# Altium project CyberDeck.PrjPcb
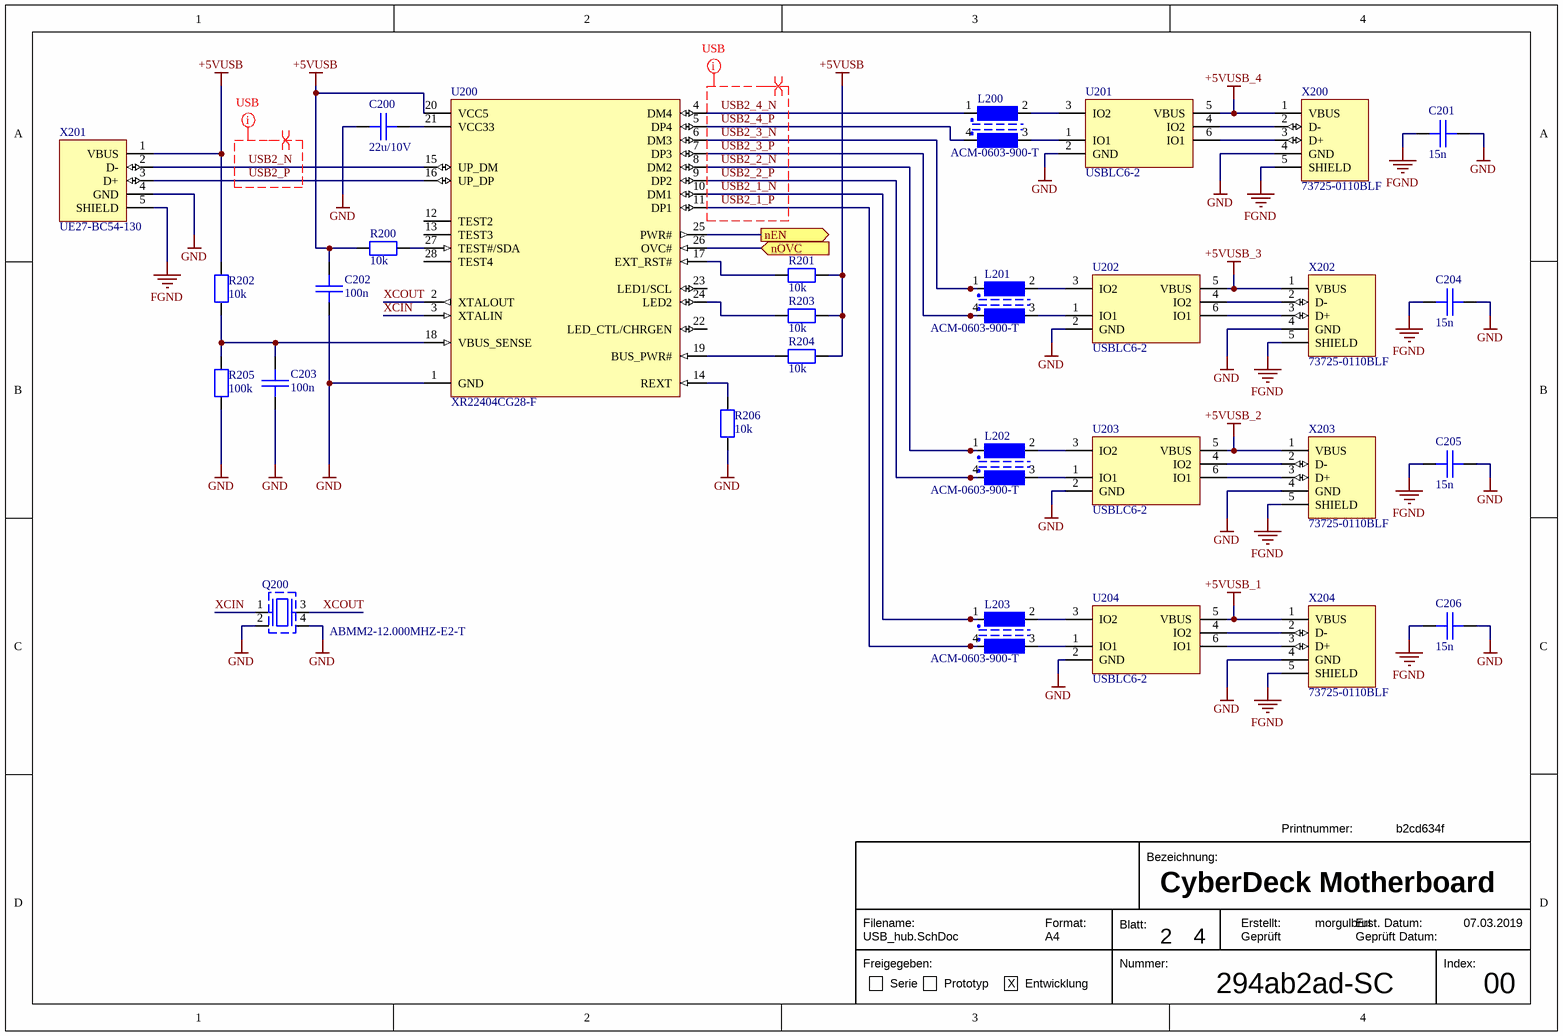
[diagram p0: USB_hub.SchDoc]
Pr_Artikel_Nr: 294ab2ad; Pr_Artikel_Revision: 00; Pr_Bezeichnung: CyberDeck Motherboard; Pr_Erstellt: morgulbrut; Pr_Erstellt_Datum: 07.03.2019; Pr_Firma: Ono-Sendai; Pr_Freig_Entw: X; Pr_PCB_Nr: b2cd634f; Pr_PCB_Revision: 00
4 sheets, 72 parts. Net scope: flat (ports and power ports of the same name join across sheets).
Board file: Cyberdeck.PcbDoc
Sheets:
  USB_hub.SchDoc
  RaspiConnection.SchDoc
  Backside.SchDoc
  USBPower.SchDoc

## Sheet USB_hub.SchDoc: USB Hub
size A4; DocumentNumber: 2; SheetNumber: 2; SheetTotal: 4; RelSerie: X

### Parts
C200  22u/10V  [0805_C_E0]
C201  15n  [0603_C]
C202  100n  [0603_C]
C203  100n  [0603_C]
C204  15n  [0603_C]
C205  15n  [0603_C]
C206  15n  [0603_C]
L200  ACM-0603-900-T  [ACM-0603-900-T]
L201  ACM-0603-900-T  [ACM-0603-900-T]
L202  ACM-0603-900-T  [ACM-0603-900-T]
L203  ACM-0603-900-T  [ACM-0603-900-T]
Q200  ABMM2-12.000MHZ-E2-T  [ABMM2]
R200  10k  [0805_R]
R201  10k  [0805_R]
R202  10k  [0805_R]
R203  10k  [0805_R]
R204  10k  [0805_R]
R205  100k  [0805_R]
R206  10k  [0805_R]
U200  XR22404CG28-F  [SSOP-28]
U201  USBLC6-2  [SOT-666]
U202  USBLC6-2  [SOT-666]
U203  USBLC6-2  [SOT-666]
U204  USBLC6-2  [SOT-666]
X200  73725-0110BLF  [73725-0110BLF]
X201  UE27-BC54-130  [UE27BC54130]
X202  73725-0110BLF  [73725-0110BLF]
X203  73725-0110BLF  [73725-0110BLF]
X204  73725-0110BLF  [73725-0110BLF]

### Ports
nEN (out), nOVC (in)

### Nets
+5VUSB: C202.2 R200.2 R201.2 R202.2 R203.2 R204.1 U200.20(VCC5) X201.1(VBUS)
+5VUSB_1: U204.5(VBUS) X204.1(VBUS)
+5VUSB_2: U203.5(VBUS) X203.1(VBUS)
+5VUSB_3: U202.5(VBUS) X202.1(VBUS)
+5VUSB_4: U201.5(VBUS) X200.1(VBUS)
FGND: C201.1 C204.1 C205.1 C206.1 X200.5(SHIELD) X201.5(SHIELD) X202.5(SHIELD) X203.5(SHIELD) X204.5(SHIELD)
GND: C200.2 C201.2 C202.1 C203.1 C204.2 C205.2 C206.2 Q200.2 Q200.4 R205.1 R206.2 U200.1(GND) U201.2(GND) U202.2(GND) U203.2(GND) U204.2(GND) X200.4(GND) X201.4(GND) X202.4(GND) X203.4(GND) X204.4(GND)
nEN: U200.25(PWR#) ; port nEN
nOVC: U200.26(OVC#) ; port nOVC
USB2_1_N: L203.1 U200.10(DM1)
USB2_1_P: L203.4 U200.11(DP1)
USB2_2_N: L202.1 U200.8(DM2)
USB2_2_P: L202.4 U200.9(DP2)
USB2_3_N: L201.1 U200.6(DM3)
USB2_3_P: L201.4 U200.7(DP3)
USB2_4_N: L200.1 U200.4(DM4)
USB2_4_P: L200.4 U200.5(DP4)
USB2_N: U200.15(UP_DM) X201.2(D-)
USB2_P: U200.16(UP_DP) X201.3(D+)
XCIN: Q200.1 U200.3(XTALIN)
XCOUT: Q200.3 U200.2(XTALOUT)
NetC200_1: C200.1 U200.21(VCC33)
NetC203_2: C203.2 R202.1 R205.2 U200.18(VBUS_SENSE)
NetL200_2: L200.2 U201.3(IO2)
NetL200_3: L200.3 U201.1(IO1)
NetL201_2: L201.2 U202.3(IO2)
NetL201_3: L201.3 U202.1(IO1)
NetL202_2: L202.2 U203.3(IO2)
NetL202_3: L202.3 U203.1(IO1)
NetL203_2: L203.2 U204.3(IO2)
NetL203_3: L203.3 U204.1(IO1)
NetR200_1: R200.1 U200.27(TEST#/SDA)
NetR201_1: R201.1 U200.17(EXT_RST#)
NetR203_1: R203.1 U200.24(LED2)
NetR204_2: R204.2 U200.19(BUS_PWR#)
NetR206_1: R206.1 U200.14(REXT)
NetU201_4: U201.4(IO2) X200.2(D-)
NetU201_6: U201.6(IO1) X200.3(D+)
NetU202_4: U202.4(IO2) X202.2(D-)
NetU202_6: U202.6(IO1) X202.3(D+)
NetU203_4: U203.4(IO2) X203.2(D-)
NetU203_6: U203.6(IO1) X203.3(D+)
NetU204_4: U204.4(IO2) X204.2(D-)
NetU204_6: U204.6(IO1) X204.3(D+)

Not connected (* = marked no-connect by the designer): U200 12(TEST2) 13(TEST3) 22(LED_CTL/CHRGEN) 23(LED1/SCL) 28(TEST4)

### Layout directives
differential pair: USB2_1_N, USB2_1_P, USB2_2_N, USB2_2_P, USB2_3_N, USB2_3_P, USB2_4_N, USB2_4_P, USB2_N, USB2_P
net class USB: USB2_1_N, USB2_1_P, USB2_2_N, USB2_2_P, USB2_3_N, USB2_3_P, USB2_4_N, USB2_4_P, USB2_N, USB2_P

### Notes on the sheet
- Bezeichnung:
- Printnummer:
- Filename:
- Format:
- Blatt:
- Erstellt:
- Erst. Datum:
- Freigegeben:
- Serie
- Prototyp
- Entwicklung
- A4
- Nummer:
- Geprüft
- Geprüft Datum:
- Index:

### Library data of the parts
C200-C206 = C: Chip capacitor, generic
L200-L203 = L_ACM-0603-900-T: INDUCTOR COMMON MODE SMD; Manufacturer: Abracon; Max Output Current: 200mA; Number of Inputs: 1; Supplier 1: Digi-Key; Supplier Part Number 1: 535-12407-1-ND; Manufacturer Part Number: ACM-0603-900-T; Case/Package: 0603; ComponentLink1URL: https://datasheet.ciiva.com/29370/acm-0603-29370512.pdf; ComponentLink1Description: https://datasheet.ciiva.com/29370/acm-0603-29370512.pdf; ComponentLink2Description: http://www.mouser.com/ds/2/115/AP21410_21510-740863.pdf; ComponentLink2URL: http://www.mouser.com/ds/2/115/AP21410_21510-740863.pdf; ComponentLink3Description: http://www.diodes.com/_files/datasheets/AP21410_21510.pdf; ComponentLink3URL: http://www.diodes.com/_files/datasheets/AP21410_21510.pdf; Contact Plating: Tin,Matte; Max Operating Temperature: 85°C; Min Operating Temperature: -40°C; Mount: Surface Mount; Number of Outputs: 1; Pricing 2: 1=0.41, 10=0.351, 100=0.2624, 500=0.2062, 1000=0.15934 (USD); Stock 2: 2006; Supplier 2: Digi-Key; Supplier Part Number 2: AP21410FM-7DICT-ND
Q200 = Q_ABMM2-12.000MHZ-E2-T: 12MHz ±20ppm Crystal 18pF 50 Ohm -20°C ~ 70°C  Surface Mount 4-SMD, No Lead (DFN, LCC); Manufacturer: Abracon; Supplier 1: Digi-Key; Supplier Part Number 1: 535-9631-1-ND; Manufacturer Part Number: ABMM2-12.000MHZ-E2-T; Case/Package: CSMD; ComponentLink1URL: https://datasheet.ciiva.com/15116/getdatasheetpartid-719825-15116727.pdf; ComponentLink1Description: https://datasheet.ciiva.com/15116/getdatasheetpartid-719825-15116727.pdf; ComponentLink2URL: https://datasheet.ciiva.com/855/abmm2-855417.pdf; ComponentLink2Description: https://datasheet.ciiva.com/855/abmm2-855417.pdf; ComponentLink3URL: https://datasheet.ciiva.com/3176/abmm2-3176137.pdf; ComponentLink3Description: https://datasheet.ciiva.com/3176/abmm2-3176137.pdf; ComponentLink4URL: https://datasheet.ciiva.com/855/abmm2-855418.pdf; ComponentLink4Description: https://datasheet.ciiva.com/855/abmm2-855418.pdf; ComponentLink5URL: https://datasheet.ciiva.com/855/abmm2-855419.pdf; ComponentLink5Description: https://datasheet.ciiva.com/855/abmm2-855419.pdf; ComponentLink6URL: https://datasheet.ciiva.com/16214/abmm2-16214428.pdf; ComponentLink6Description: https://datasheet.ciiva.com/16214/abmm2-16214428.pdf
R200-R206 = R: Resistor, generic
U200 = U_T_XR22404CG28-F: USB Controller USB 2.0 USB Interface; Manufacturer: Exar; Supplier 1: Digi-Key; Supplier Part Number 1: 1016-2163-ND; Manufacturer Part Number: XR22404CG28-F; ComponentLink1Description: Datasheet; ComponentLink1URL: https://www.exar.com/ds/xr22404.pdf
U201-U204 = D_USBLC6-2: TVS DIODE 5.25VWM 17VC SOT666; Manufacturer: STMicroelectronics; Manufacturer Part Number: USBLC6-2P6; Supplier 1: Digi-Key; Supplier Part Number 1: 497-5026-1-ND; ComponentLink1URL: https://datasheet.ciiva.com/15143/getdatasheetpartid-98673-15143462.pdf; ComponentLink1Description: https://datasheet.ciiva.com/15143/getdatasheetpartid-98673-15143462.pdf; ComponentLink2URL: https://datasheet.ciiva.com/14186/usblc6-2-st-eng-tds-14186568.pdf; ComponentLink2Description: https://datasheet.ciiva.com/14186/usblc6-2-st-eng-tds-14186568.pdf; ComponentLink3URL: https://datasheet.ciiva.com/22692/1690354-22692453.pdf; ComponentLink3Description: https://datasheet.ciiva.com/22692/1690354-22692453.pdf; ComponentLink4URL: https://datasheet.ciiva.com/22685/1690354-22685832.pdf; ComponentLink4Description: https://datasheet.ciiva.com/22685/1690354-22685832.pdf; ComponentLink5URL: https://datasheet.ciiva.com/16378/cd00050750-16378714.pdf; ComponentLink5Description: https://datasheet.ciiva.com/16378/cd00050750-16378714.pdf; ComponentLink6URL: https://datasheet.ciiva.com/4508/cd00050750-4508892.pdf; ComponentLink6Description: https://datasheet.ciiva.com/4508/cd00050750-4508892.pdf; ComponentLink7URL: https://datasheet.ciiva.com/41444/001184108-da-01-en-ic-esd-protection-usblc6-2p6-sot-666-stm-41444134.pdf; ComponentLink7Description: https://datasheet.ciiva.com/41444/001184108-da-01-en-ic-esd-protection-usblc6-2p6-sot-666-stm-41444134.pdf; Case/Package: SOT-666
X200 X202-X204 = X_73725-0110BLF: CONN RCPT USB2.0 TYPEA 4POS R/A
X201 = X_UE27-BC54-130: USB Connectors 4P PCB R/A TYPE B BLACK W/ REAR SHIELD; Manufacturer 1: Amphenol Commercial; Manufacturer Part Number 1: UE27-BC54-130; ComponentLink1URL: https://datasheet.ciiva.com/10945/ue27bcx4xxx-10945210.pdf; ComponentLink1Description: https://datasheet.ciiva.com/10945/ue27bcx4xxx-10945210.pdf; ComponentLink2URL: https://datasheet.ciiva.com/851/ue27bcx4xxx-851809.pdf; ComponentLink2Description: https://datasheet.ciiva.com/851/ue27bcx4xxx-851809.pdf; ComponentLink3URL: https://datasheet.ciiva.com/16668/ue27bcx4xxx-16668218.pdf; ComponentLink3Description: https://datasheet.ciiva.com/16668/ue27bcx4xxx-16668218.pdf; Supplier 1: Digi-Key; Supplier Part Number 1: UE27BC54130-ND

## Sheet RaspiConnection.SchDoc
size A4; DocumentNumber: 1; SheetNumber: 1; SheetTotal: 4; RelSerie: X
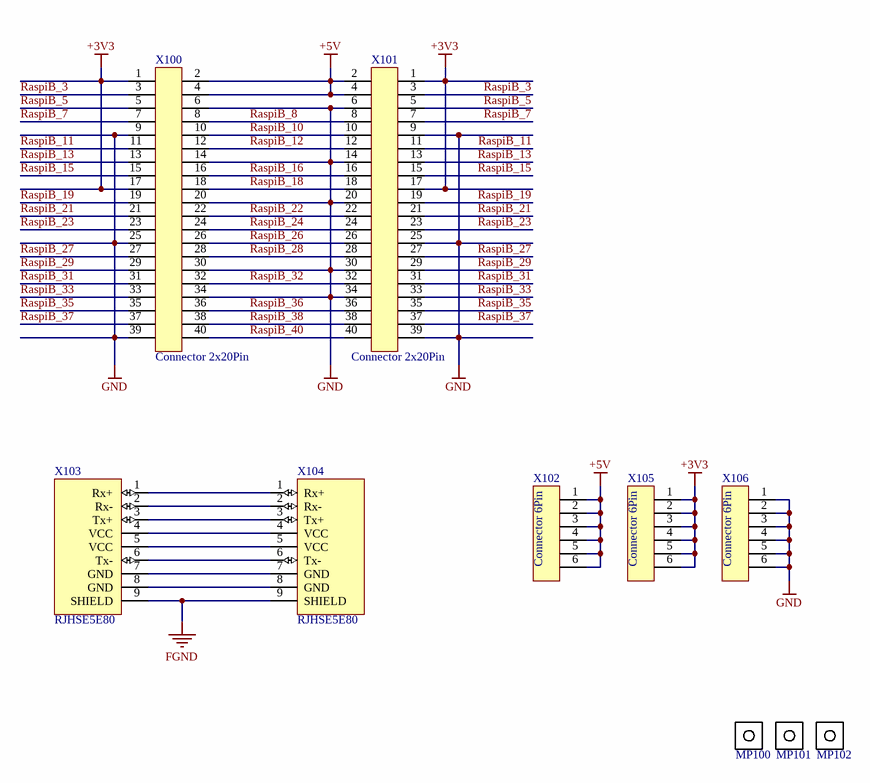
[diagram p1: RaspiConnection.SchDoc]

### Parts
MP100  Mounting Hole  [M3x08S]  (value not drawn)  (no BOM)
MP101  Mounting Hole  [M3x08S]  (value not drawn)  (no BOM)
MP102  Mounting Hole  [M3x08S]  (value not drawn)  (no BOM)
X100  Connector 2x20Pin  [Pin Header 2x20 TH Pitch 2.54mm - sh]
X101  Connector 2x20Pin  [Pin Header 2x20 SMD Pitch 2.54mm F]
X102  Connector 6Pin  [Pin Header 1x6 TH Pitch 2.54mm]
X103  RJHSE5E80  [RJ45]
X104  RJHSE5E80  [RJ45]
X105  Connector 6Pin  [Pin Header 1x6 TH Pitch 2.54mm]
X106  Connector 6Pin  [Pin Header 1x6 TH Pitch 2.54mm]

### Nets
+3V3: X100.1 X100.17 X101.1 X101.17 X105.1 X105.2 X105.3 X105.4 X105.5 X105.6
+5V: X100.2 X100.4 X101.2 X101.4 X102.1 X102.2 X102.3 X102.4 X102.5 X102.6
FGND: X103.9(SHIELD) X104.9(SHIELD)
GND: X100.6 X100.9 X100.14 X100.20 X100.25 X100.30 X100.34 X100.39 X101.6 X101.9 X101.14 X101.20 X101.25 X101.30 X101.34 X101.39 X106.1 X106.2 X106.3 X106.4 X106.5 X106.6
RaspiB_3: X100.3 X101.3
RaspiB_5: X100.5 X101.5
RaspiB_7: X100.7 X101.7
RaspiB_8: X100.8 X101.8
RaspiB_10: X100.10 X101.10
RaspiB_11: X100.11 X101.11
RaspiB_12: X100.12 X101.12
RaspiB_13: X100.13 X101.13
RaspiB_15: X100.15 X101.15
RaspiB_16: X100.16 X101.16
RaspiB_18: X100.18 X101.18
RaspiB_19: X100.19 X101.19
RaspiB_21: X100.21 X101.21
RaspiB_22: X100.22 X101.22
RaspiB_23: X100.23 X101.23
RaspiB_24: X100.24 X101.24
RaspiB_26: X100.26 X101.26
RaspiB_27: X100.27 X101.27
RaspiB_28: X100.28 X101.28
RaspiB_29: X100.29 X101.29
RaspiB_31: X100.31 X101.31
RaspiB_32: X100.32 X101.32
RaspiB_33: X100.33 X101.33
RaspiB_35: X100.35 X101.35
RaspiB_36: X100.36 X101.36
RaspiB_37: X100.37 X101.37
RaspiB_38: X100.38 X101.38
RaspiB_40: X100.40 X101.40
NetX103_1: X103.1(Rx+) X104.1(Rx+)
NetX103_2: X103.2(Rx-) X104.2(Rx-)
NetX103_3: X103.3(Tx+) X104.3(Tx+)
NetX103_4: X103.4(VCC) X104.4(VCC)
NetX103_5: X103.5(VCC) X104.5(VCC)
NetX103_6: X103.6(Tx-) X104.6(Tx-)
NetX103_7: X103.7(GND) X104.7(GND)
NetX103_8: X103.8(GND) X104.8(GND)

### Notes on the sheet
- Bezeichnung:
- Printnummer:
- Filename:
- Format:
- Blatt:
- Erstellt:
- Erst. Datum:
- Freigegeben:
- Serie
- Prototyp
- Entwicklung
- A4
- Nummer:
- Geprüft
- Geprüft Datum:
- Index:

### Library data of the parts
MP100-MP102 = MP_Mounting Hole: Different Mounting holes
X100 = X_Connector 2x20Pin: Generic connector 2x20 Pin
X101 = X_Connector 2x20Pin_1: Generic connector 2x20 Pin
X102 X105 X106 = X_Connector 6Pin: Generic connector 6 Pin
X103 X104 = X_RJHSE5E80: Modular Connectors / Ethernet Connectors High Speed RJ w/no LED's or Shield; Manufacturer 1: Amphenol Commercial; Voltage Rating: 125V; Manufacturer Part Number 1: RJHSE5E80; Termination: Solder; ComponentLink1URL: http://www.mouser.com/ds/2/18/Amphenol_RJHSE_BRO-311217.pdf; ComponentLink1Description: http://www.mouser.com/ds/2/18/Amphenol_RJHSE_BRO-311217.pdf; ComponentLink2URL: https://www.amphenolcanada.com/ProductSearch/pdf/RJHSE_BRO.pdf; ComponentLink2Description: https://www.amphenolcanada.com/ProductSearch/pdf/RJHSE_BRO.pdf; Supplier 1: Digi-Key; Supplier Part Number 1: RJHSE5E80-ND; ComponentLink3URL: https://datasheet.ciiva.com/16408/eng-cd-6368150-b1-16408714.pdf; ComponentLink3Description: https://datasheet.ciiva.com/16408/eng-cd-6368150-b1-16408714.pdf; ComponentLink4URL: https://datasheet.ciiva.com/30494/0900766b8121d3d0-30494389.pdf; ComponentLink4Description: https://datasheet.ciiva.com/30494/0900766b8121d3d0-30494389.pdf; ComponentLink5URL: https://datasheet.ciiva.com/30086/63681501-30086239.pdf; ComponentLink5Description: https://datasheet.ciiva.com/30086/63681501-30086239.pdf; ComponentLink7URL: https://datasheet.ciiva.com/685/eng-cd-6368150-c1-685799.pdf; ComponentLink7Description: https://datasheet.ciiva.com/685/eng-cd-6368150-c1-685799.pdf

## Sheet Backside.SchDoc
size A4; DocumentNumber: 3; SheetNumber: 3; SheetTotal: 4; RelSerie: X
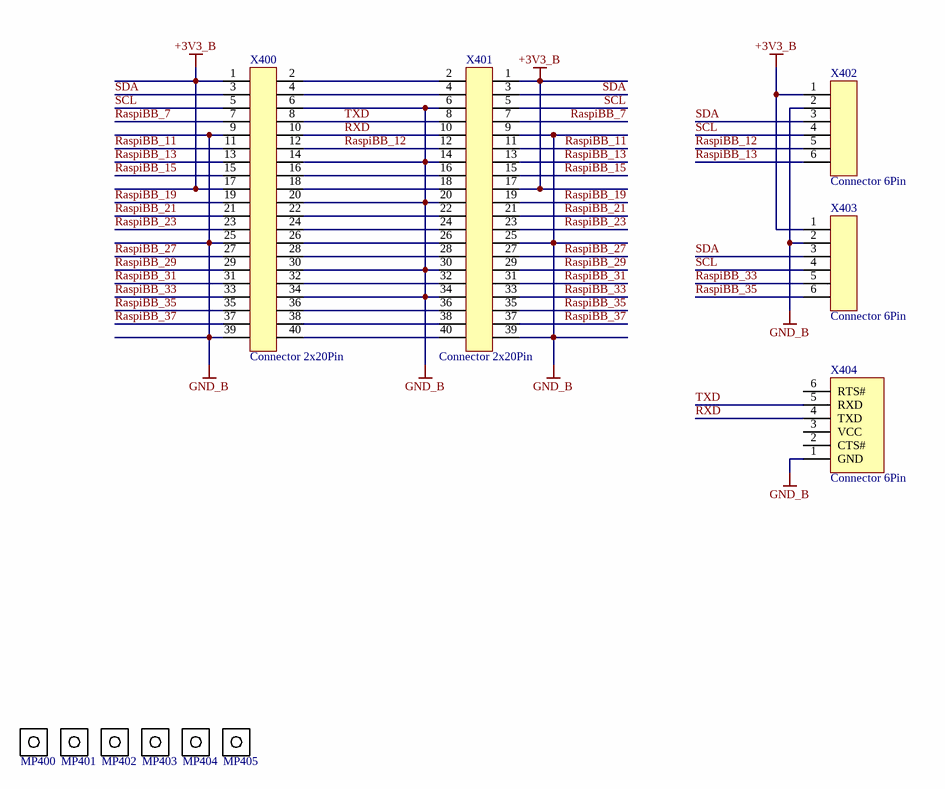
[diagram p2: Backside.SchDoc]

### Parts
MP400  Mounting Hole  [M2 2.3]  (value not drawn)  (no BOM)
MP401  Mounting Hole  [M2 2.3]  (value not drawn)  (no BOM)
MP402  Mounting Hole  [M2 2.3]  (value not drawn)  (no BOM)
MP403  Mounting Hole  [M2 2.3]  (value not drawn)  (no BOM)
MP404  Mounting Hole  [M2 2.3]  (value not drawn)  (no BOM)
MP405  Mounting Hole  [M2 2.3]  (value not drawn)  (no BOM)
X400  Connector 2x20Pin  [Pin Header 2x20 TH Pitch 2.54mm - sh]
X401  Connector 2x20Pin  [Pin Header 2x20 TH Pitch 2.54mm - sh]
X402  Connector 6Pin  [Pin Header 2x3 TH Pitch 2.54mm f]
X403  Connector 6Pin  [Pin Header 2x3 TH Pitch 2.54mm f]
X404  Connector 6Pin  [Pin Header 1x6 TH Pitch 2.54mm]

### Nets
+3V3_B: X400.1 X400.17 X401.1 X401.17 X402.1 X403.1
GND_B: X400.6 X400.9 X400.14 X400.20 X400.25 X400.30 X400.34 X400.39 X401.6 X401.9 X401.14 X401.20 X401.25 X401.30 X401.34 X401.39 X402.2 X403.2 X404.1(GND)
RaspiBB_7: X400.7 X401.7
RaspiBB_11: X400.11 X401.11
RaspiBB_12: X400.12 X401.12 X402.5
RaspiBB_13: X400.13 X401.13 X402.6
RaspiBB_15: X400.15 X401.15
RaspiBB_19: X400.19 X401.19
RaspiBB_21: X400.21 X401.21
RaspiBB_23: X400.23 X401.23
RaspiBB_27: X400.27 X401.27
RaspiBB_29: X400.29 X401.29
RaspiBB_31: X400.31 X401.31
RaspiBB_33: X400.33 X401.33 X403.5
RaspiBB_35: X400.35 X401.35 X403.6
RaspiBB_37: X400.37 X401.37
RXD: X400.10 X401.10 X404.4(TXD)
SCL: X400.5 X401.5 X402.4 X403.4
SDA: X400.3 X401.3 X402.3 X403.3
TXD: X400.8 X401.8 X404.5(RXD)
NetX400_2: X400.2 X401.2
NetX400_4: X400.4 X401.4
NetX400_16: X400.16 X401.16
NetX400_18: X400.18 X401.18
NetX400_22: X400.22 X401.22
NetX400_24: X400.24 X401.24
NetX400_26: X400.26 X401.26
NetX400_28: X400.28 X401.28
NetX400_32: X400.32 X401.32
NetX400_36: X400.36 X401.36
NetX400_38: X400.38 X401.38
NetX400_40: X400.40 X401.40

Not connected (* = marked no-connect by the designer): X404 2(CTS#) 3(VCC) 6(RTS#)

### Notes on the sheet
- Bezeichnung:
- Printnummer:
- Filename:
- Format:
- Blatt:
- Erstellt:
- Erst. Datum:
- Freigegeben:
- Serie
- Prototyp
- Entwicklung
- A4
- Nummer:
- Geprüft
- Geprüft Datum:
- Index:

### Library data of the parts
MP400-MP405 = MP_Mounting Hole: Different Mounting holes
X400 X401 = X_Connector 2x20Pin: Generic connector 2x20 Pin
X402 X403 = X_Connector 6Pin: Generic connector 6 Pin
X404 = X_Connector FTDI cable: Connector 6 Pin for FTDI cable; Manufacturer: Mill-Max; Manufacturer Part Number: 419-10-206-00-006000; Number of Contacts: 6; Pitch: 0.1inch; Supplier 1: Digi-Key; Supplier Part Number 1: ED1376-ND; Stock 1: 291; Pricing 1: 1=4.33, 10=4.152, 100=3.46, 500=2.941, 1000=2.5085 (USD); Mount: Through Hole; Material: Brass; Contact Plating: Gold; Packaging: Bulk; Number of Rows: 2; Row Spacing: 0.1inch; ComponentLink1URL: https://www.mill-max.com/assets/pdfs/021.2.PDF; ComponentLink1Description: https://www.mill-max.com/assets/pdfs/021.2.PDF

## Sheet USBPower.SchDoc
size A4; DocumentNumber: 4; SheetNumber: 4; SheetTotal: 4; RelSerie: X
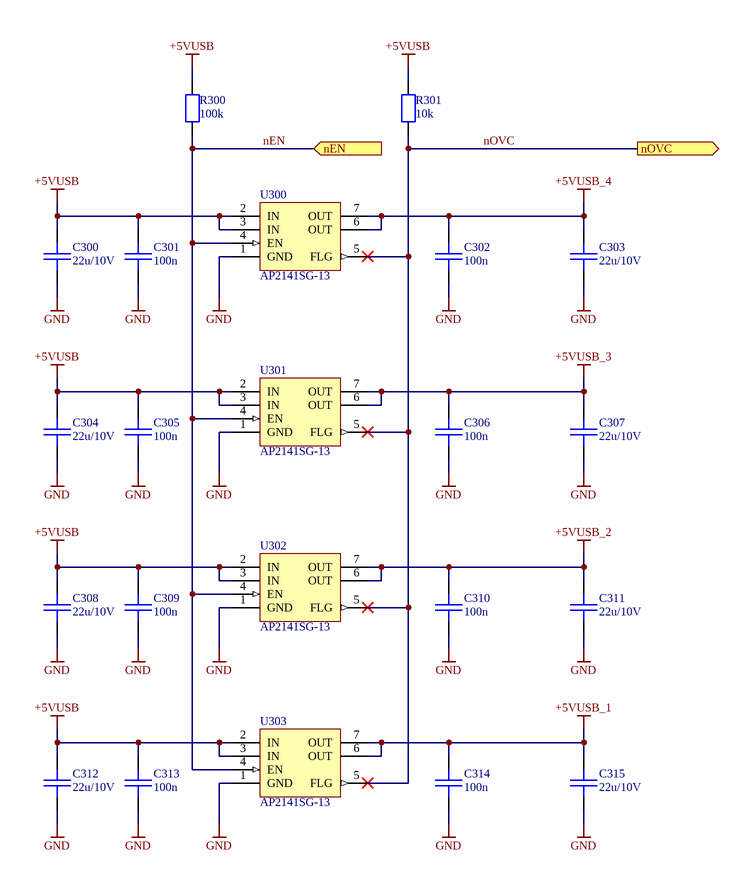
[diagram p3: USBPower.SchDoc]

### Parts
C300  22u/10V  [0805_C_E0]
C301  100n  [0603_C]
C302  100n  [0603_C]
C303  22u/10V  [0805_C_E0]
C304  22u/10V  [0805_C_E0]
C305  100n  [0603_C]
C306  100n  [0603_C]
C307  22u/10V  [0805_C_E0]
C308  22u/10V  [0805_C_E0]
C309  100n  [0603_C]
C310  100n  [0603_C]
C311  22u/10V  [0805_C_E0]
C312  22u/10V  [0805_C_E0]
C313  100n  [0603_C]
C314  100n  [0603_C]
C315  22u/10V  [0805_C_E0]
R300  100k  [0603_R]
R301  10k  [0603_R]
U300  AP2141SG-13  [SO8]
U301  AP2141SG-13  [SO8]
U302  AP2141SG-13  [SO8]
U303  AP2141SG-13  [SO8]

### Ports
nEN (in), nOVC (out)

### Nets
+5VUSB: C300.2 C301.2 C304.2 C305.2 C308.2 C309.2 C312.2 C313.2 R300.2 R301.2 U300.2(IN) U300.3(IN) U301.2(IN) U301.3(IN) U302.2(IN) U302.3(IN) U303.2(IN) U303.3(IN)
+5VUSB_1: C314.2 C315.2 U303.6(OUT) U303.7(OUT)
+5VUSB_2: C310.2 C311.2 U302.6(OUT) U302.7(OUT)
+5VUSB_3: C306.2 C307.2 U301.6(OUT) U301.7(OUT)
+5VUSB_4: C302.2 C303.2 U300.6(OUT) U300.7(OUT)
GND: C300.1 C301.1 C302.1 C303.1 C304.1 C305.1 C306.1 C307.1 C308.1 C309.1 C310.1 C311.1 C312.1 C313.1 C314.1 C315.1 U300.1(GND) U301.1(GND) U302.1(GND) U303.1(GND)
nEN: R300.1 U300.4(EN) U301.4(EN) U302.4(EN) U303.4(EN) ; port nEN
nOVC: R301.1 U300.5(FLG) U301.5(FLG) U302.5(FLG) U303.5(FLG) ; port nOVC

### Notes on the sheet
- Bezeichnung:
- Printnummer:
- Filename:
- Format:
- Blatt:
- Erstellt:
- Erst. Datum:
- Freigegeben:
- Serie
- Prototyp
- Entwicklung
- A4
- Nummer:
- Geprüft
- Geprüft Datum:
- Index:

### Library data of the parts
C300-C315 = C: Chip capacitor, generic
R300 R301 = R: Resistor, generic
U300-U303 = U_Q_AP2141SG-13: 0.5A SINGLE CHANNEL CURRENT-LIMITED POWERSWITCH SOIC8; Manufacturer: Diodes; Number of Outputs: 1; Current Rating: 800mA; Max Supply Voltage: 5.5V; Min Supply Voltage: 2.7V; Interface: On/Off; Max Output Current: 500mA; On-State Resistance: 95mR; Fault Protection: Over Temperature,Reverse Current; Output Configuration: High Side; ComponentLink1URL: https://datasheet.ciiva.com/15108/getdatasheetpartid-661768-15108858.pdf; ComponentLink1Description: https://datasheet.ciiva.com/15108/getdatasheetpartid-661768-15108858.pdf; ComponentLink2URL: https://datasheet.ciiva.com/26882/ap2141fmg-7-26882490.pdf; ComponentLink2Description: https://datasheet.ciiva.com/26882/ap2141fmg-7-26882490.pdf; ComponentLink3URL: https://datasheet.ciiva.com/1962/ap2141-51-1962188.pdf; ComponentLink3Description: https://datasheet.ciiva.com/1962/ap2141-51-1962188.pdf; ComponentLink4URL: https://datasheet.ciiva.com/1962/ap2141-51-1962189.pdf; ComponentLink4Description: https://datasheet.ciiva.com/1962/ap2141-51-1962189.pdf; ComponentLink5URL: https://datasheet.ciiva.com/1962/ap2141-51-1962190.pdf; ComponentLink5Description: https://datasheet.ciiva.com/1962/ap2141-51-1962190.pdf; Supplier 1: Digi-Key; Supplier Part Number 1: AP2141SGDICT-ND; Manufacturer Part Number: AP2141SG-13; RoHS: Yes; Stock 1: 5779; Pricing 1: 1 = 0.70000, 10 = 0.61200, 100 = 0.46910, 500 = 0.37080, 1000 = 0.29664 (USD); Mount: Surface Mount; Case/Package: SOP; Number of Pins: 8; Weight: 0.030018oz; Min Operating Temperature: -40°C; Max Operating Temperature: 85°C; Package Quantity: 2500; Packaging: Tape and Reel; Voltage: 5.5V; Current: 500mA; Length: 5.3mm; Height: 1.5mm; Width: 4.1mm; Radiation Hardening: No; REACH SVHC: No SVHC; Lead Free: Lead Free; ComponentLink6URL: http://www.farnell.com/datasheets/608802.pdf?src-supplier=Farnell; ComponentLink6Description: http://www.farnell.com/datasheets/608802.pdf?src-supplier=Farnell; ComponentLink7URL: http://www.farnell.com/datasheets/608802.pdf?src-supplier=Element14; ComponentLink7Description: http://www.farnell.com/datasheets/608802.pdf?src-supplier=Element14; ComponentLink8URL: http://www.diodes.com/datasheets/AP2141_51.pdf?src-supplier=Avnet; ComponentLink8Description: http://www.diodes.com/datasheets/AP2141_51.pdf?src-supplier=Avnet; ComponentLink9URL: https://www.verical.com/server-webapp/html/getDatasheet?partID=670762&src-supplier=Verical; ComponentLink9Description: https://www.verical.com/server-webapp/html/getDatasheet?partID=670762&src-supplier=Verical; ComponentLink10URL: http://www.farnell.com/datasheets/2238439.pdf?src-supplier=Element14; ComponentLink10Description: http://www.farnell.com/datasheets/2238439.pdf?src-supplier=Element14; ComponentLink11URL: http://www.diodes.com/datasheets/AP2141_51.pdf?src-supplier=Future+Electronics; ComponentLink11Description: http://www.diodes.com/datasheets/AP2141_51.pdf?src-supplier=Future+Electronics; ComponentLink12URL: https://www.diodes.com/assets/Datasheets/AP2141-51.pdf?src-supplier=Digi-Key; ComponentLink12Description: https://www.diodes.com/assets/Datasheets/AP2141-51.pdf?src-supplier=Digi-Key

## Nets that join several sheets
+5VUSB: USB_hub (8 pins), USBPower (18 pins)
+5VUSB_1: USB_hub (U204.5 X204.1), USBPower (C314.2 C315.2 U303.6 U303.7)
+5VUSB_2: USB_hub (U203.5 X203.1), USBPower (C310.2 C311.2 U302.6 U302.7)
+5VUSB_3: USB_hub (U202.5 X202.1), USBPower (C306.2 C307.2 U301.6 U301.7)
+5VUSB_4: USB_hub (U201.5 X200.1), USBPower (C302.2 C303.2 U300.6 U300.7)
FGND: USB_hub (9 pins), RaspiConnection (X103.9 X104.9)
GND: USB_hub (21 pins), RaspiConnection (22 pins), USBPower (20 pins)
nEN: USB_hub (U200.25), USBPower (5 pins)
nOVC: USB_hub (U200.26), USBPower (5 pins)

## Assembly variants
Default: not fitted X102 X105 X106 X402 X403 X404
StepOutput: all parts fitted